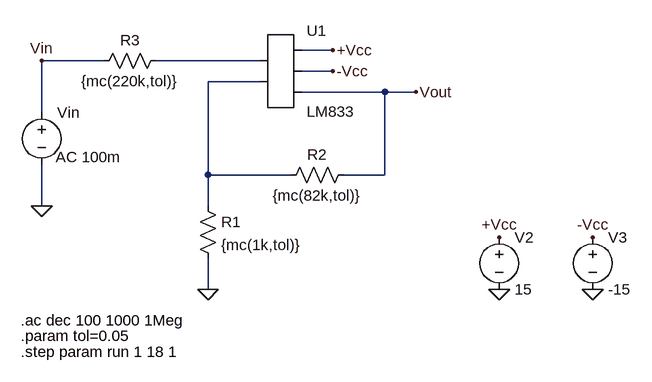
[diagram p0: schematic opamp LM833.asc]
opamp LM833.asc, the LTspice schematic file:
Version 4
SHEET 1 880 680
WIRE 288 144 240 144
WIRE -64 160 -160 160
WIRE 176 160 16 160
WIRE 288 176 240 176
WIRE 176 192 96 192
WIRE 368 208 240 208
WIRE 416 208 368 208
WIRE -160 240 -160 160
WIRE 96 336 96 192
WIRE 224 336 96 336
WIRE 368 336 368 208
WIRE 368 336 304 336
WIRE -160 384 -160 320
WIRE 96 384 96 336
WIRE 96 512 96 464
FLAG 288 144 +Vcc
FLAG 288 176 -Vcc
FLAG 96 512 0
FLAG -160 384 0
FLAG 416 208 Vout
FLAG 544 512 0
FLAG 688 512 0
FLAG 544 432 +Vcc
FLAG 688 432 -Vcc
FLAG -160 160 Vin
SYMBOL AutoGenerated\\LM833 208 176 R0
SYMATTR InstName U1
SYMBOL res 80 368 R0
SYMATTR InstName R1
SYMATTR Value {mc(1k,tol)}
SYMBOL res 320 320 R90
WINDOW 0 0 56 VBottom 2
WINDOW 3 32 56 VTop 2
SYMATTR InstName R2
SYMATTR Value {mc(82k,tol)}
SYMBOL res 32 144 R90
WINDOW 0 0 56 VBottom 2
WINDOW 3 32 56 VTop 2
SYMATTR InstName R3
SYMATTR Value {mc(220k,tol)}
SYMBOL voltage -160 224 R0
WINDOW 123 22 84 Left 2
WINDOW 39 0 0 Left 0
WINDOW 3 18 105 Left 2
SYMATTR Value2 AC 100m
SYMATTR Value ""
SYMATTR InstName Vin
SYMBOL voltage 544 416 R0
SYMATTR InstName V2
SYMATTR Value 15
SYMBOL voltage 688 416 R0
SYMATTR InstName V3
SYMATTR Value -15
TEXT -192 560 Left 2 !.ac dec 100 1000 1Meg
TEXT -192 584 Left 2 !.param tol=0.05
TEXT -192 608 Left 2 !.step param run 1 18 1

The netlist it stands for:
* opamp LM833.asc
* U1: LM833 (symbol AutoGenerated\LM833 not available, pins judged from their places): pin1=N001 pin2=N002 pin3=+Vcc pin4=-Vcc pin5=Vout
R1 N002 0 {mc(1k,tol)}
R2 Vout N002 {mc(82k,tol)}
R3 N001 Vin {mc(220k,tol)}
Vin Vin 0 AC 100m
V2 +Vcc 0 15
V3 -Vcc 0 -15
.ac dec 100 1000 1Meg
.param tol=0.05
.step param run 1 18 1
.backanno
.end